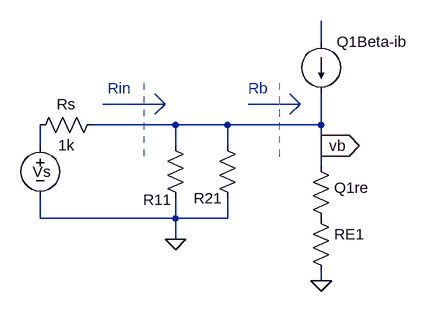
[diagram p0: schematic AC-equiv__Q1_Rin.asc]
AC-equiv__Q1_Rin.asc, the LTspice schematic file:
Version 4
SHEET 1 880 680
WIRE 512 -32 512 -64
WIRE 288 96 160 96
WIRE 368 96 288 96
WIRE 512 96 512 48
WIRE 512 96 368 96
WIRE 80 128 80 96
WIRE 288 128 288 96
WIRE 368 128 368 96
WIRE 512 128 512 96
WIRE 512 160 512 128
WIRE 80 240 80 208
WIRE 288 240 288 208
WIRE 288 240 80 240
WIRE 368 240 368 208
WIRE 368 240 288 240
WIRE 288 272 288 240
WIRE 512 336 512 320
FLAG 288 272 0
FLAG 512 336 0
FLAG 512 128 vb
IOPIN 512 128 Out
SYMBOL voltage 80 112 R0
WINDOW 0 -12 56 Left 2
WINDOW 123 0 0 Left 0
WINDOW 39 0 0 Left 0
SYMATTR InstName Vs
SYMATTR Value ""
SYMBOL res 272 112 R0
WINDOW 0 -34 99 Left 2
SYMATTR InstName R11
SYMATTR Value ""
SYMBOL res 352 112 R0
WINDOW 0 -36 97 Left 2
SYMATTR InstName R21
SYMATTR Value ""
SYMBOL res 496 144 R0
WINDOW 0 36 49 Left 2
SYMATTR InstName Q1re
SYMATTR Value ""
SYMBOL res 496 224 R0
SYMATTR InstName RE1
SYMATTR Value ""
SYMBOL current 512 -32 R0
SYMATTR InstName Q1Beta-ib
SYMATTR Value ""
SYMBOL res 176 80 R90
WINDOW 0 0 56 VBottom 2
WINDOW 3 32 56 VTop 2
SYMATTR InstName Rs
SYMATTR Value 1k
TEXT 184 40 Left 2 ;Rin
TEXT 400 40 Left 2 ;Rb
LINE Normal 240 144 240 32 2
LINE Normal 448 144 448 32 2
LINE Normal 272 64 176 64
LINE Normal 480 64 400 64
LINE Normal 480 64 480 64
LINE Normal 272 64 256 48
LINE Normal 256 80 272 64
LINE Normal 480 64 464 48
LINE Normal 464 80 480 64

The netlist it stands for:
* AC-equiv__Q1_Rin.asc
Vs N002 0
R11 vb 0
R21 vb 0
R§Q1re vb P001
RE1 P001 0
I§Q1Beta-ib N001 vb
Rs vb N002 1k
* Rin
* Rb
.backanno
.end